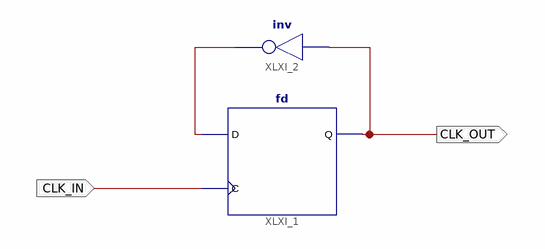
[diagram p0: schematic sheet 1]
// Xilinx ISE schematic CLK_Divider.sch (spartan6) as structural Verilog: 2 symbols, 2 ports
module CLK_Divider (
  input  CLK_IN,
  output CLK_OUT
);

  wire XLXN_1;

  fd XLXI_1 (.C(CLK_IN), .D(XLXN_1), .Q(CLK_OUT));
  not XLXI_2 (XLXN_1, CLK_OUT);
endmodule
